# EAGLE design Moses_Ft._Creamer (EAGLE 9.6.2)
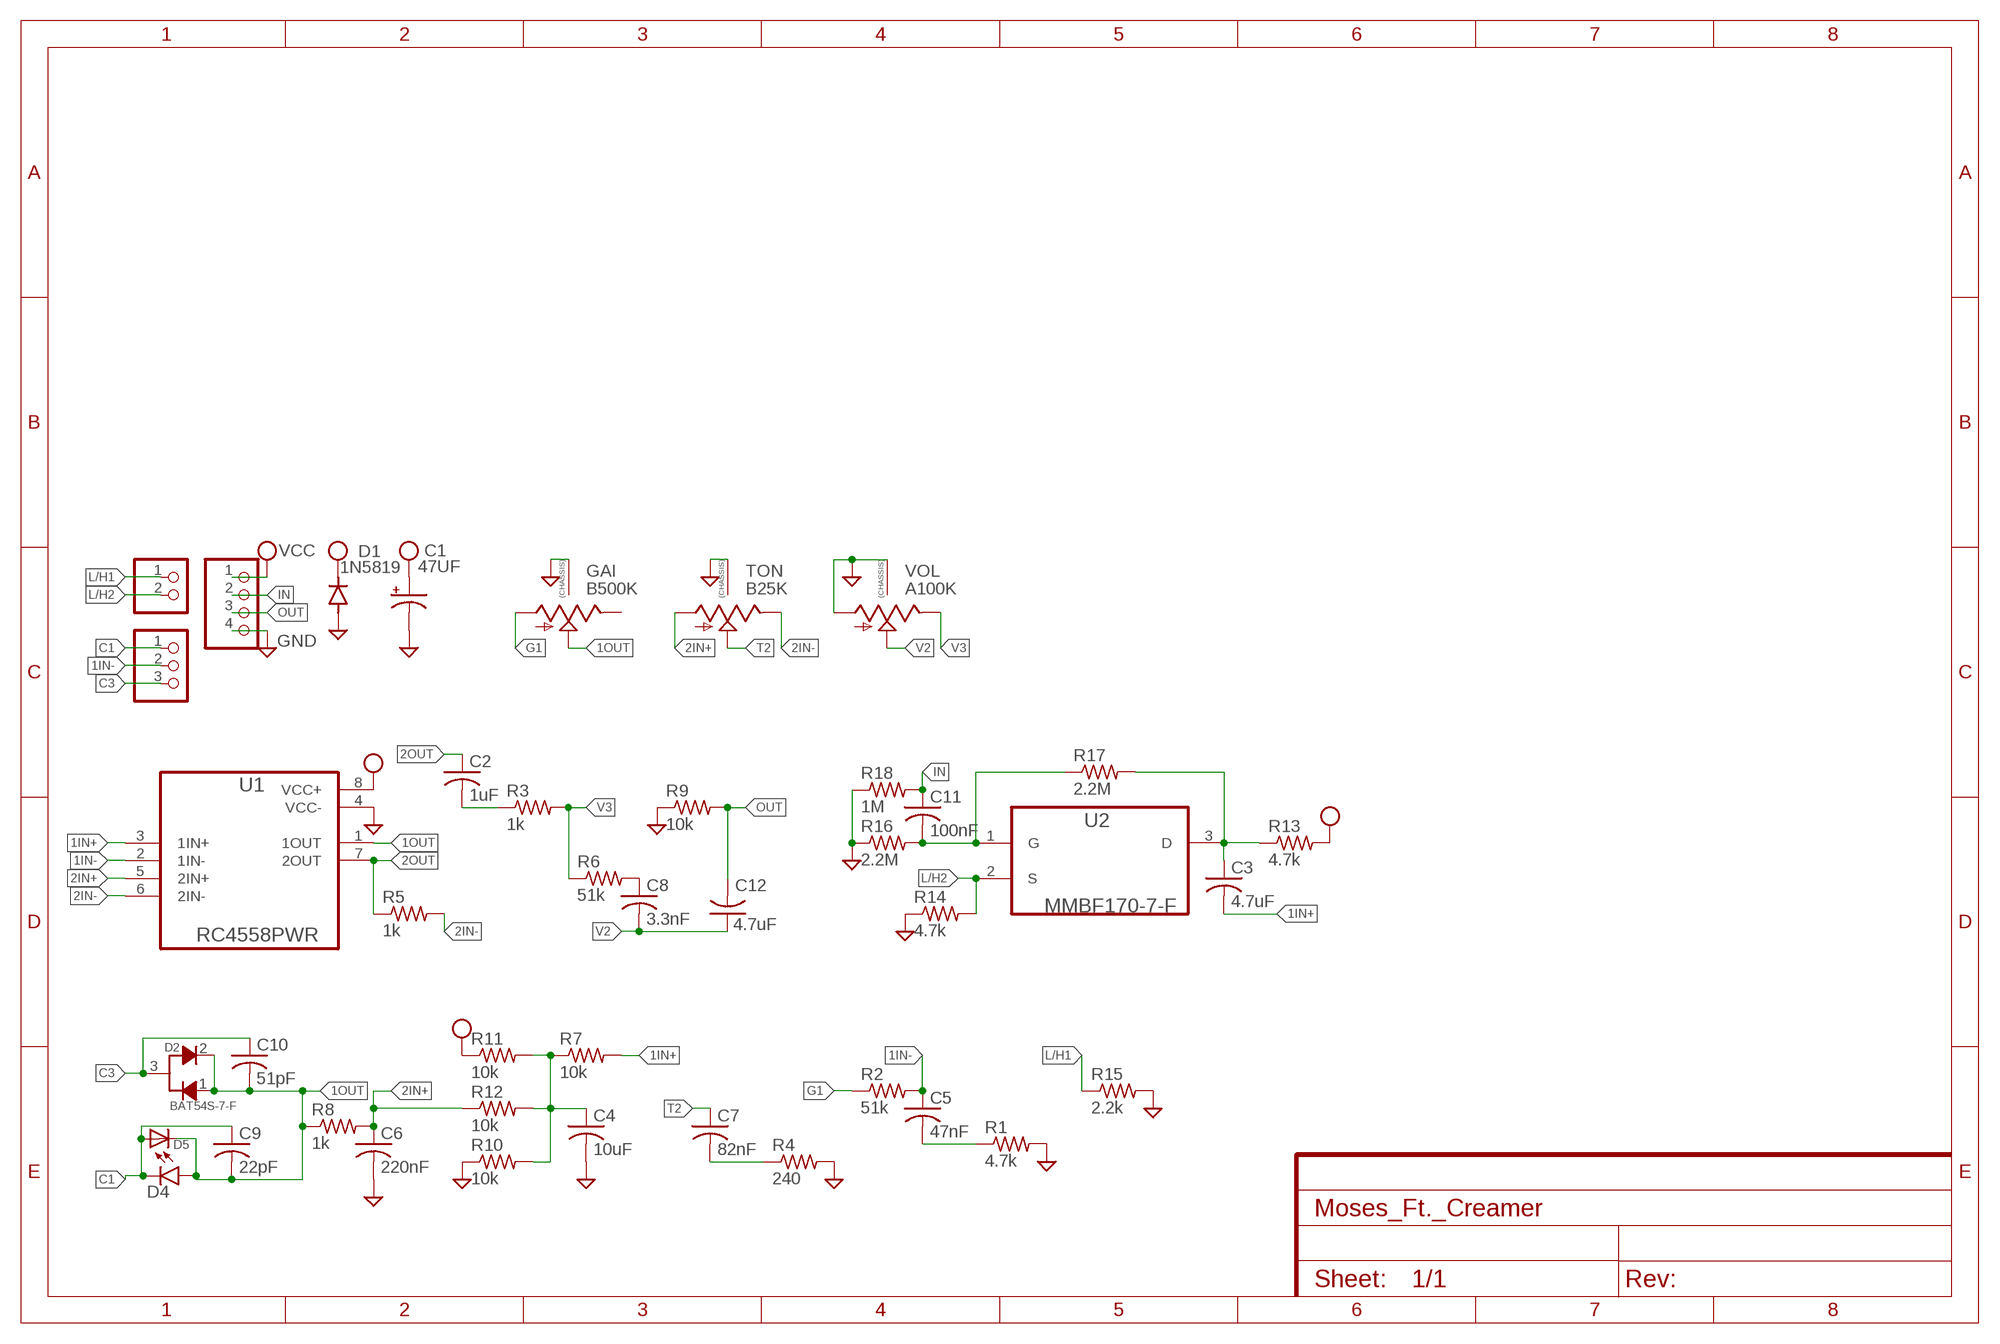
[diagram p0: schematic, sheet 1]

## Parts
C1  47UF  CAP_SMD+THRUPAN_B  [PAN_B_SMD+THRU]
C2  1uF  C-USC0805  [C0805]
C3  4.7uF  C-USC1206  [C1206]
C4  10uF  C-USC1206  [C1206]
C5  47nF  C-USC0603  [C0603]
C6  220nF  C-USC0603  [C0603]
C7  82nF  C-USC0603  [C0603]
C8  3.3nF  C-USC0603  [C0603]
C9  22pF  C-USC0603  [C0603]
C10  51pF  C-USC0603  [C0603]
C11  100nF  C-USC0603  [C0603]
C12  4.7uF  C-USC1206  [C1206]
D1  1N5819  DIODE-SOD123  [SOD123]
D2  BAT54S-7-F  [SOT23-3]
D4  LED0603  [LED-0603]
D5  DIODESOD-123  [SOD-123]
GAI  B500K  9MM_SNAP-IN_POT_CHASSIS  [9MM_SNAP-IN_POT]
JP1  PINHD-1X4  [1X04]
JP2  PINHD-1X2  [1X02]
JP3  PINHD-1X3  [1X03]
R1  4.7k  R-US_R0603  [R0603]
R2  51k  R-US_R0603  [R0603]
R3  1k  R-US_R0603  [R0603]
R4  240  R-US_R0603  [R0603]
R5  1k  R-US_R0603  [R0603]
R6  51k  R-US_R0603  [R0603]
R7  10k  R-US_R0603  [R0603]
R8  1k  R-US_R0603  [R0603]
R9  10k  R-US_R0603  [R0603]
R10  10k  R-US_R0603  [R0603]
R11  10k  R-US_R0603  [R0603]
R12  10k  R-US_R0603  [R0603]
R13  4.7k  R-US_R0603  [R0603]
R14  4.7k  R-US_R0603  [R0603]
R15  2.2k  R-US_R0603  [R0603]
R16  2.2M  R-US_R0603  [R0603]
R17  2.2M  R-US_R0603  [R0603]
R18  1M  R-US_R0603  [R0603]
TON  B25K  9MM_SNAP-IN_POT_CHASSIS  [9MM_SNAP-IN_POT]
U1  RC4558PWR  [SOP65P640X120-8N]
U2  MMBF170-7-F  [SOT103P240X110-3N]
VOL  A100K  9MM_SNAP-IN_POT_CHASSIS  [9MM_SNAP-IN_POT]

## Nets
1IN+: C3.2 R7.2 U1.3(1IN+)
1IN-: C5.1 JP3.2 R2.2 U1.2(1IN-)
1OUT: C9.2 C10.2 D2.1 D2.2 D4.A D5.C GAI.2(S) R8.1 U1.1(1OUT)
2IN+: C6.1 R8.2 R12.1 TON.1(A) U1.5(2IN+)
2IN-: R5.2 TON.3(E) U1.6(2IN-)
2OUT: C2.1 R5.1 U1.7(2OUT)
C1: C9.1 D4.C D5.A JP3.1
C3: C10.1 D2.3 JP3.3
G1: GAI.1(A) R2.1
GND: C1.- C1.--(-) C4.2 C6.2 D1.A GAI.CHASSIS1 GAI.CHASSIS2 JP1.4 R1.2 R4.2 R9.1 R10.1 R14.1 R15.2 R16.1 R18.1 TON.CHASSIS1 TON.CHASSIS2 U1.4(VCC-) VOL.1(A) VOL.CHASSIS1 VOL.CHASSIS2
IN: C11.1 JP1.2 R18.2
L/H1: JP2.1 R15.1
L/H2: JP2.2 R14.2 U2.2(S)
N$1: C11.2 R16.2 R17.1 U2.1(G)
N$2: C3.1 R13.1 R17.2 U2.3(D)
N$3: C5.2 R1.1
N$4: C4.1 R7.1 R10.2 R11.2 R12.2
N$5: C2.2 R3.1
N$6: C7.2 R4.1
N$7: C8.1 R6.2
OUT: C12.2 JP1.3 R9.2
T2: C7.1 TON.2(S)
V2: C8.2 C12.1 VOL.2(S)
V3: R3.2 R6.1 VOL.3(E)
VCC: C1.+ C1.++(+) D1.C JP1.1 R11.1 R13.2 U1.8(VCC+)
Unconnected: GAI.3(E)

## Library data of the parts
C1 = MusicThingModular:CAP_SMD+THRU
C2-C12 = adafruit:C-US: CAPACITOR, American symbol
D1 = diode:DIODE-: DIODE
D2 = Diodes:BAT54S-7-F: DIODE ARRAY SCHOTTKY 30V SOT23-3 Manufacturer's datasheet <https://www.diodes.com/assets/Datasheets/ds11005.pdf>; CREATED_BY: PCBLayout.com; DIGIKEY_PART_NUMBER: BAT54S-FDITR-ND; MANUFACTURER: Diodes Incorporated; MPN: BAT54S-7-F; PACKAGE: SOT-23
D4 = SparkFun-LED:LED: LED (Generic) Standard schematic elements and footprints for 5mm, 3mm, 1206, and 0603 sized LEDs. Generic LEDs with no color specified.
D5 = adafruit:DIODE: Diode SMADIODE - SMA Surface Mount Package 20V 1A Schottky Diode Digikey: 641-1014-6-ND DO-1N4148 - Through Hole Small Current Diode SOD-123 20V 1 A (.5mV Vf) Schottky Diode - Digikey: MBRX120TPMSCT-ND SOD-323 10V 570mA (.38mV Vf, 3ns) Schottky Diode - Digikey: ZLLS410CT-ND SOD-523 30V 30mA Schottky Diode (RB751S-40TE61) - Digikey: RB751S-40TE61CT-ND SOT23-R/W - SOT23 Package (R = Solder Paste/Reflow Ovens, W = Hand-Soldering) BAT54Film 40V 300mA - Digikey: 497-7162-1-ND
GAI TON VOL = MusicThingModular:9MM_SNAP-IN_POT_CHASSIS: 9mm vertical snap-in pot, Alpha / Panasonic style, with a connection to the metal chassis for grounding
JP1 = Connector:PINHD-1X4: PIN HEADER; CATEGORY: CONNECTOR; SUB-CATEGORY: PIN-HEADER
JP2 = pinhead:PINHD-1X2: PIN HEADER
JP3 = pinhead:PINHD-1X3: PIN HEADER
R1-R18 = adafruit:R-US_: RESISTOR, American symbol
U1 = RC4558PWR:RC4558PWR: None Check prices <https://pricing.snapeda.com/search/part/RC4558PWR/?ref=eda>; AVAILABILITY: Good; DESCRIPTION: Dual General-Purpose Operational Amplifier 8-TSSOP 0 to 70; MF: Texas Instruments; MP: RC4558PWR; PACKAGE: TSSOP-8 Texas Instruments; PRICE: None; PURCHASE-URL: https://pricing.snapeda.com/search/part/RC4558PWR/?ref=eda
U2 = MMBF170-7-F:MMBF170-7-F: N-CHANNEL ENHANCEMENT MODE FIELD EFFECT TRANSISTOR; AVAILABILITY: Unavailable; DESCRIPTION: N-Channel 60V 500mA _Ta_ 300mW _Ta_ Surface Mount SOT-23-3; MF: Diodes Inc.; MP: MMBF170-7-F; PACKAGE: SOT-23-3 Diodes Inc.; PRICE: None

## Board
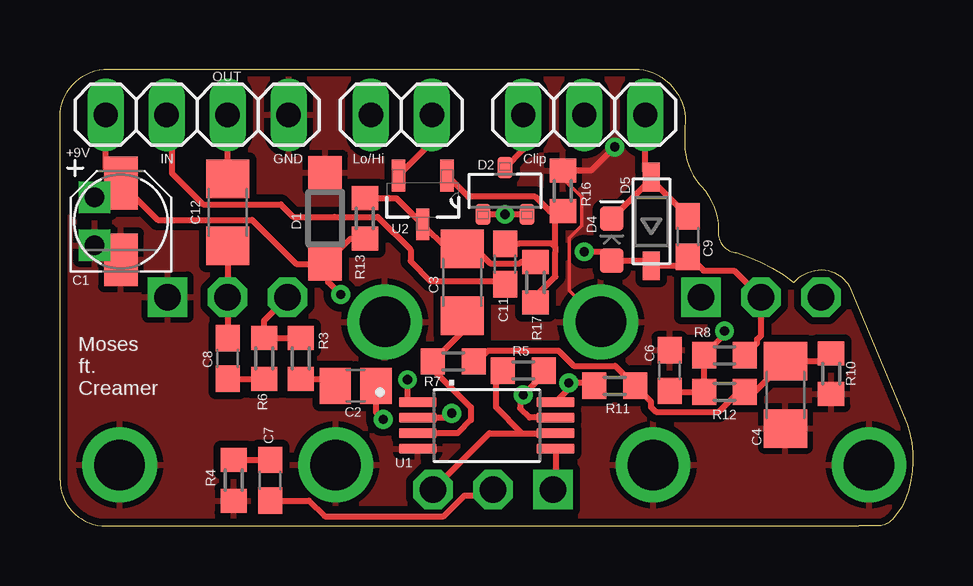
[diagram p1: board, top side]
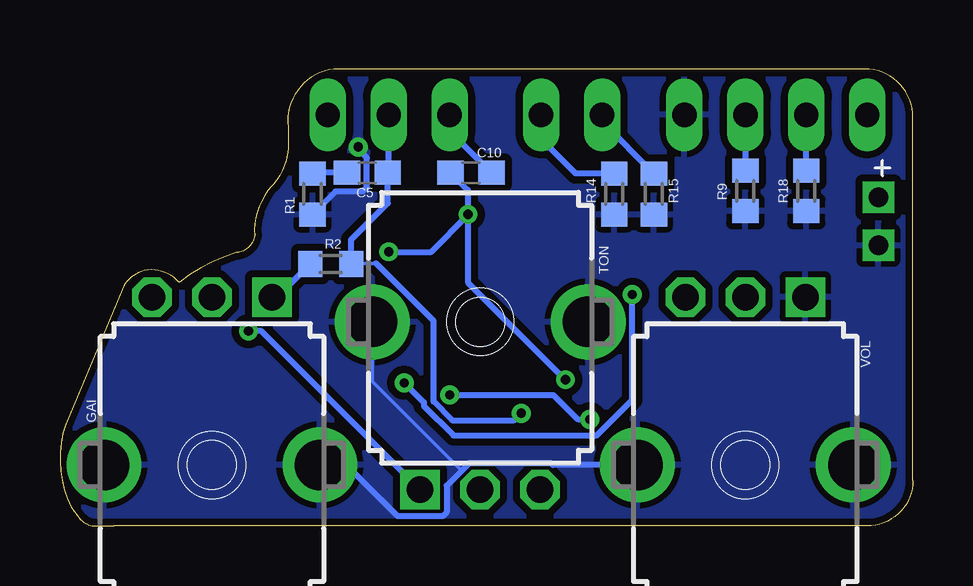
[diagram p2: board, bottom side, seen from below]

Size 35.54 x 19.05 mm. Coordinates in mm from the lower left corner, seen from the top.
Outline: 1.91,0 33.27,0 34.06,0 arc45 34.67,0.25 35.07,0.78 arc45 35.31,4.23 32.89,10 arc45 32.02,10.65 31.73,10.69 arc45 30.57,10.16 arc20 28.2,11.4 arc-79 27.43,12.11 arc45 26.72,14.17 26.65,14.24 arc-45 26.04,16.16 26.04,16.64 arc90 24.13,19.05 2,19.05 arc90 0,17.05 0,1.91 arc90 1.91,0
Copper layers (1*16): Top 0.035mm / dielectric 1.5mm / Bottom 0.035mm
Design rules "default *": minimum track width 6mil, minimum drill 0.35mm, track to track 6mil, track to pad 6mil, pad to pad 6mil, via to via 6mil, smd to smd 6mil, copper to edge 10mil, drill to drill 6mil, minimum pad ring 10mil, minimum via ring 8mil, stop-mask expansion 4mil, vias tented up to drill 0mil, thermal gap 10mil

### Footprints (pad centres in the part's own frame; a part is rotated, then mirrored left to right if it is on the bottom)
PAN_B_SMD+THRU = smd 2.2 x 1.4: + 1.6,0; - -1.6,0 | drill 0.8 pad 0.9 square: ++ 1,1.1; -- -1,1.1
C0805 = smd 1.3 x 1.5: 1 -0.85,0; 2 0.85,0
C1206 = smd 1.6 x 1.8: 1 -1.4,0; 2 1.4,0
C0603 = smd 1.1 x 1: 1 -0.85,0; 2 0.85,0
SOD123 = smd 1.4 x 1.4: A 1.9,0; C -1.9,0
SOT23-3 = smd 0.63 x 0.9: 1 -0.915,-0.975; 2 0.915,-0.975; 3 0,0.975
LED-0603 = smd 1 x 1: A -0.877,0; C 0.877,0
SOD-123 = smd 1.2 x 0.7: A 1.85,0; C -1.85,0
9MM_SNAP-IN_POT = drill 1.1 square: 1 -2.5,-7 | drill 1.1 octagon: 2 0,-7; 3 2.5,-7 | drill 2.1 pad 2.794: CHASSIS1 -4.5,0; CHASSIS2 4.5,0
1X04 = drill 1.016 long: 1 -3.81,0; 2 -1.27,0; 3 1.27,0; 4 3.81,0
1X02 = drill 1.016 long: 1 -1.27,0; 2 1.27,0
1X03 = drill 1.016 long: 1 -2.54,0; 2 0,0; 3 2.54,0
R0603 = smd 1 x 1.1: 1 -0.85,0; 2 0.85,0
SOP65P640X120-8N = smd 1.57 x 0.41: 1 -2.87,0.975; 2 -2.87,0.325; 3 -2.87,-0.325; 4 -2.87,-0.975; 5 2.87,-0.975; 6 2.87,-0.325; 7 2.87,0.325; 8 2.87,0.975
SOT103P240X110-3N = smd 1.321 x 0.559: 1 -1.016,1.016; 2 -1.016,-1.016; 3 1.016,0

### Placement (x,y rotation side)
C1  2.54,12.7 90 top
C2  12.32,5.84 180 top
C3  16.76,10.16 270 top
C4  30.23,5.46 270 top
C5  22.73,14.73 180 bottom
C6  25.4,6.48 90 top
C7  8.76,1.91 90 top
C8  6.99,6.99 90 top
C9  26.16,12.06 270 top
C10  18.41,14.73 180 bottom
C11  18.54,10.92 90 top
C12  6.99,13.08 90 top
D1  11.05,12.83 90 top
D2  18.54,13.97 0 top
D4  22.99,11.94 90 top
D5  24.64,12.7 90 top
GAI  29.21,2.54 180 bottom
JP1  5.71,17.14 0 top
JP2  14.22,17.14 0 top
JP3  21.84,17.14 180 top
R1  25.02,13.84 270 bottom
R2  24.26,10.92 0 bottom
R3  10.03,6.99 90 top
R4  7.24,1.91 270 top
R5  19.3,6.48 180 top
R6  8.51,6.99 270 top
R7  16.38,6.86 180 top
R8  27.69,7.11 180 top
R9  6.99,13.97 90 bottom
R10  32.13,6.35 90 top
R11  23.11,5.84 0 top
R12  27.69,5.59 0 top
R13  12.7,12.83 270 top
R14  12.45,13.84 90 bottom
R15  10.79,13.84 270 bottom
R16  20.95,13.97 270 top
R17  19.81,10.16 90 top
R18  4.45,13.97 90 bottom
TON  18.03,8.51 0 bottom
U1  17.78,4.19 0 top
U2  15.11,13.59 270 top
VOL  6.99,2.54 180 bottom

### Tracks (layer width: path | path; a pad name or v marks a point on that pad's centre or on a via)
1IN+
  Top 0.254: C3.2 16.76,8.09 R7.2 15.53,6.53 17.12,4.95 17.12,4.42 16.57,3.87 U1.3
1IN-  (via drill 0.38)
  Top 0.254: U1.2 16.13,4.52 v16.32,4.7
  Bottom 0.152: 22.37,10.95 23.38,10.95 R2.2
  Bottom 0.254: JP3.2 21.84,14.77 C5.1 21.88,13.46 23.41,11.94 R2.2 | v16.32,4.7 16.61,4.41 19.2,4.41 19.98,5.18 19.98,8.55 22.37,10.95
1OUT  (via drill 0.38)
  Top 0.254: D2.1 v18.54,12.99 D2.2 | D5.C 24.77,10.85 | 24.77,10.85 25.8,10.85 C9.2 26.25,11.21 26.82,10.64 28.09,10.64 29.21,9.53 | 24.77,10.85 24.55,11.06 D4.A 22.62,11.43 v21.84,11.43 | R8.1 29.05,7.62 29.05,7.78 29.21,7.94 29.21,9.53 | 29.21,9.53 GAI.2 | v14.48,6.1 14.48,5.33 14.64,5.17 U1.1
  Bottom 0.254: C10.2 18.54,14.01 v18.54,12.99 18.54,12.95 | 18.54,12.95 18.54,10.16 v14.48,6.1 | v21.84,11.43 20.07,11.43 18.54,12.95
2IN+  (via drill 0.38)
  Top 0.254: U1.5 20.65,1.62 TON.1 | C6.1 25.44,5.59 R12.1 R8.2 27.69,7.96 v27.69,8.13
  Bottom 0.254: TON.1 27.15,8.13 v27.69,8.13
2IN-
  Top 0.254: R5.2 18.16,6.18 18.16,4.95 19.25,3.87 | 19.25,3.87 U1.6 | TON.3 17.89,3.87 19.25,3.87
2OUT  (via drill 0.38)
  Top 0.254: U1.7 19.56,4.52 19.18,4.9 19.18,5.21 19.3,5.33 v19.3,5.46 20.15,6.31 R5.1 | v13.46,4.45 13.17,4.74 C2.1
  Bottom 0.254: v19.3,5.46 14.99,5.46 13.97,4.45 v13.46,4.45
C1
  Top 0.254: JP3.1 24.38,14.8 D5.A 24.64,14.48 24.64,14.47 | C9.1 24.64,14.44 24.64,14.47 | D4.C 24.64,14.47
C3
  Top 0.254: D2.3 19.3,15.71 JP3.3
  Bottom 0.254: C10.1 19.3,16.47 JP3.3
G1
  Bottom 0.254: R2.1 26.49,9.54 GAI.1
GND  (via drill 0.38)
  Top 0.152: R16.1 20.95,14.49 21.73,13.71 21.73,12.53 21.22,12.01 21.22,9.82 TON.CHASSIS1
  Top 0.254: v23.11,15.8 22.13,14.82 R16.1
  Bottom 0.152: TON.CHASSIS1 22.53,6.02 18.81,2.3
  Bottom 0.254: v23.11,15.8 23.11,15.71 22.75,15.35 22.75,14.12 22.92,13.95 24.06,13.95 R1.2 | VOL.CHASSIS2 15,2.54 15.08,2.61 18.49,2.61 18.81,2.3 19.43,1.68 19.43,0.57 19.59,0.41 21.48,0.41 23.61,2.54 GAI.CHASSIS1
  pour Top (isolate 0.305): -1.27,-1.27 36.83,-1.27 36.83,20.32 -1.27,20.32
  pour Bottom (isolate 0.305): -1.27,-1.27 36.83,-1.27 36.83,20.32 -1.27,20.32
IN
  Top 0.254: JP1.2 4.66,16.93 4.66,14.71 5.97,13.4 9.2,13.4 9.72,12.88 11.43,12.88 13.24,12.88 14.61,11.52 14.61,11.05 15.46,10.2 18.41,10.2 C11.1
  Bottom 0.254: R18.2 JP1.2
L/H1
  Bottom 0.254: R15.1 12.95,16.85 JP2.1
L/H2
  Top 0.254: U2.2 15.49,16 JP2.2
  Bottom 0.254: R14.2 14.06,14.69 15.49,16.13 JP2.2
N$1
  Top 0.254: R16.2 20.83,13.12 | 20.83,13.12 20.4,13.12 19.79,13.72 17.01,13.72 U2.1 | R17.1 19.81,9.56 20.64,10.39 20.64,11.43 20.64,11.63 | 20.83,13.12 20.64,12.93 20.64,11.63 | 20.64,11.63 20.48,11.79 19.15,11.79 19.13,11.77 C11.2
N$2
  Top 0.254: R13.1 13.69,13.68 13.7,13.66 14.02,13.66 U2.3 16.13,11.56 C3.1 17.31,11.56 17.93,10.94 19.16,10.94 19.23,11.01 R17.2
N$3
  Bottom 0.254: C5.2 24.98,14.73 R1.1
N$4
  Top 0.254: R7.1 17.39,6.86 17.84,7.31 20.77,7.31 21.41,6.67 23.14,6.67 R11.2 24.62,5.18 24.62,4.96 24.82,4.76 27.45,4.76 28.28,5.59 R12.2 28.95,5.59 C4.1 31.79,6.86 R10.2
N$5
  Top 0.254: R3.1 11.18,6.13 C2.2
N$6
  Top 0.254: R4.1 C7.2
N$7
  Top 0.254: C8.1 R6.2
OUT
  Top 0.254: C12.2 JP1.3
  Bottom 0.254: JP1.3 R9.2
T2
  Top 0.254: C7.1 10.37,1.05 11.02,0.41 15.99,0.41 16.86,1.27 17.8,1.27 TON.2
V2
  Top 0.254: C12.1 VOL.2 C8.2
V3
  Top 0.254: VOL.3 8.51,8.56 R6.1 R3.2
VCC  (via drill 0.38)
  Top 0.254: C1.+ 1.91,14.94 JP1.1 | C1.++ 2.04,14.3 C1.+ | 11.17,11.05 D1.C 9.83,10.93 8,12.76 4.08,12.76 C1.+ | 11.17,11.05 12.1,11.98 R13.2 | U1.8 21.2,5.72 v21.2,5.97 22.14,5.97 R11.1 | v11.69,9.64 11.17,10.16 11.17,11.05
  Bottom 0.254: v21.2,5.97 20.38,5.15 20.38,5.01 19.14,3.77 13.18,3.77 11.7,5.26 v11.7,9.64 v11.69,9.64

### Text on the board
tPlace: OUT | +9V | IN | GND | Lo/Hi | Clip | . | Moses / ft. / Creamer